# EAGLE design SensoryOverload-v1.0 (EAGLE 6.5.0)
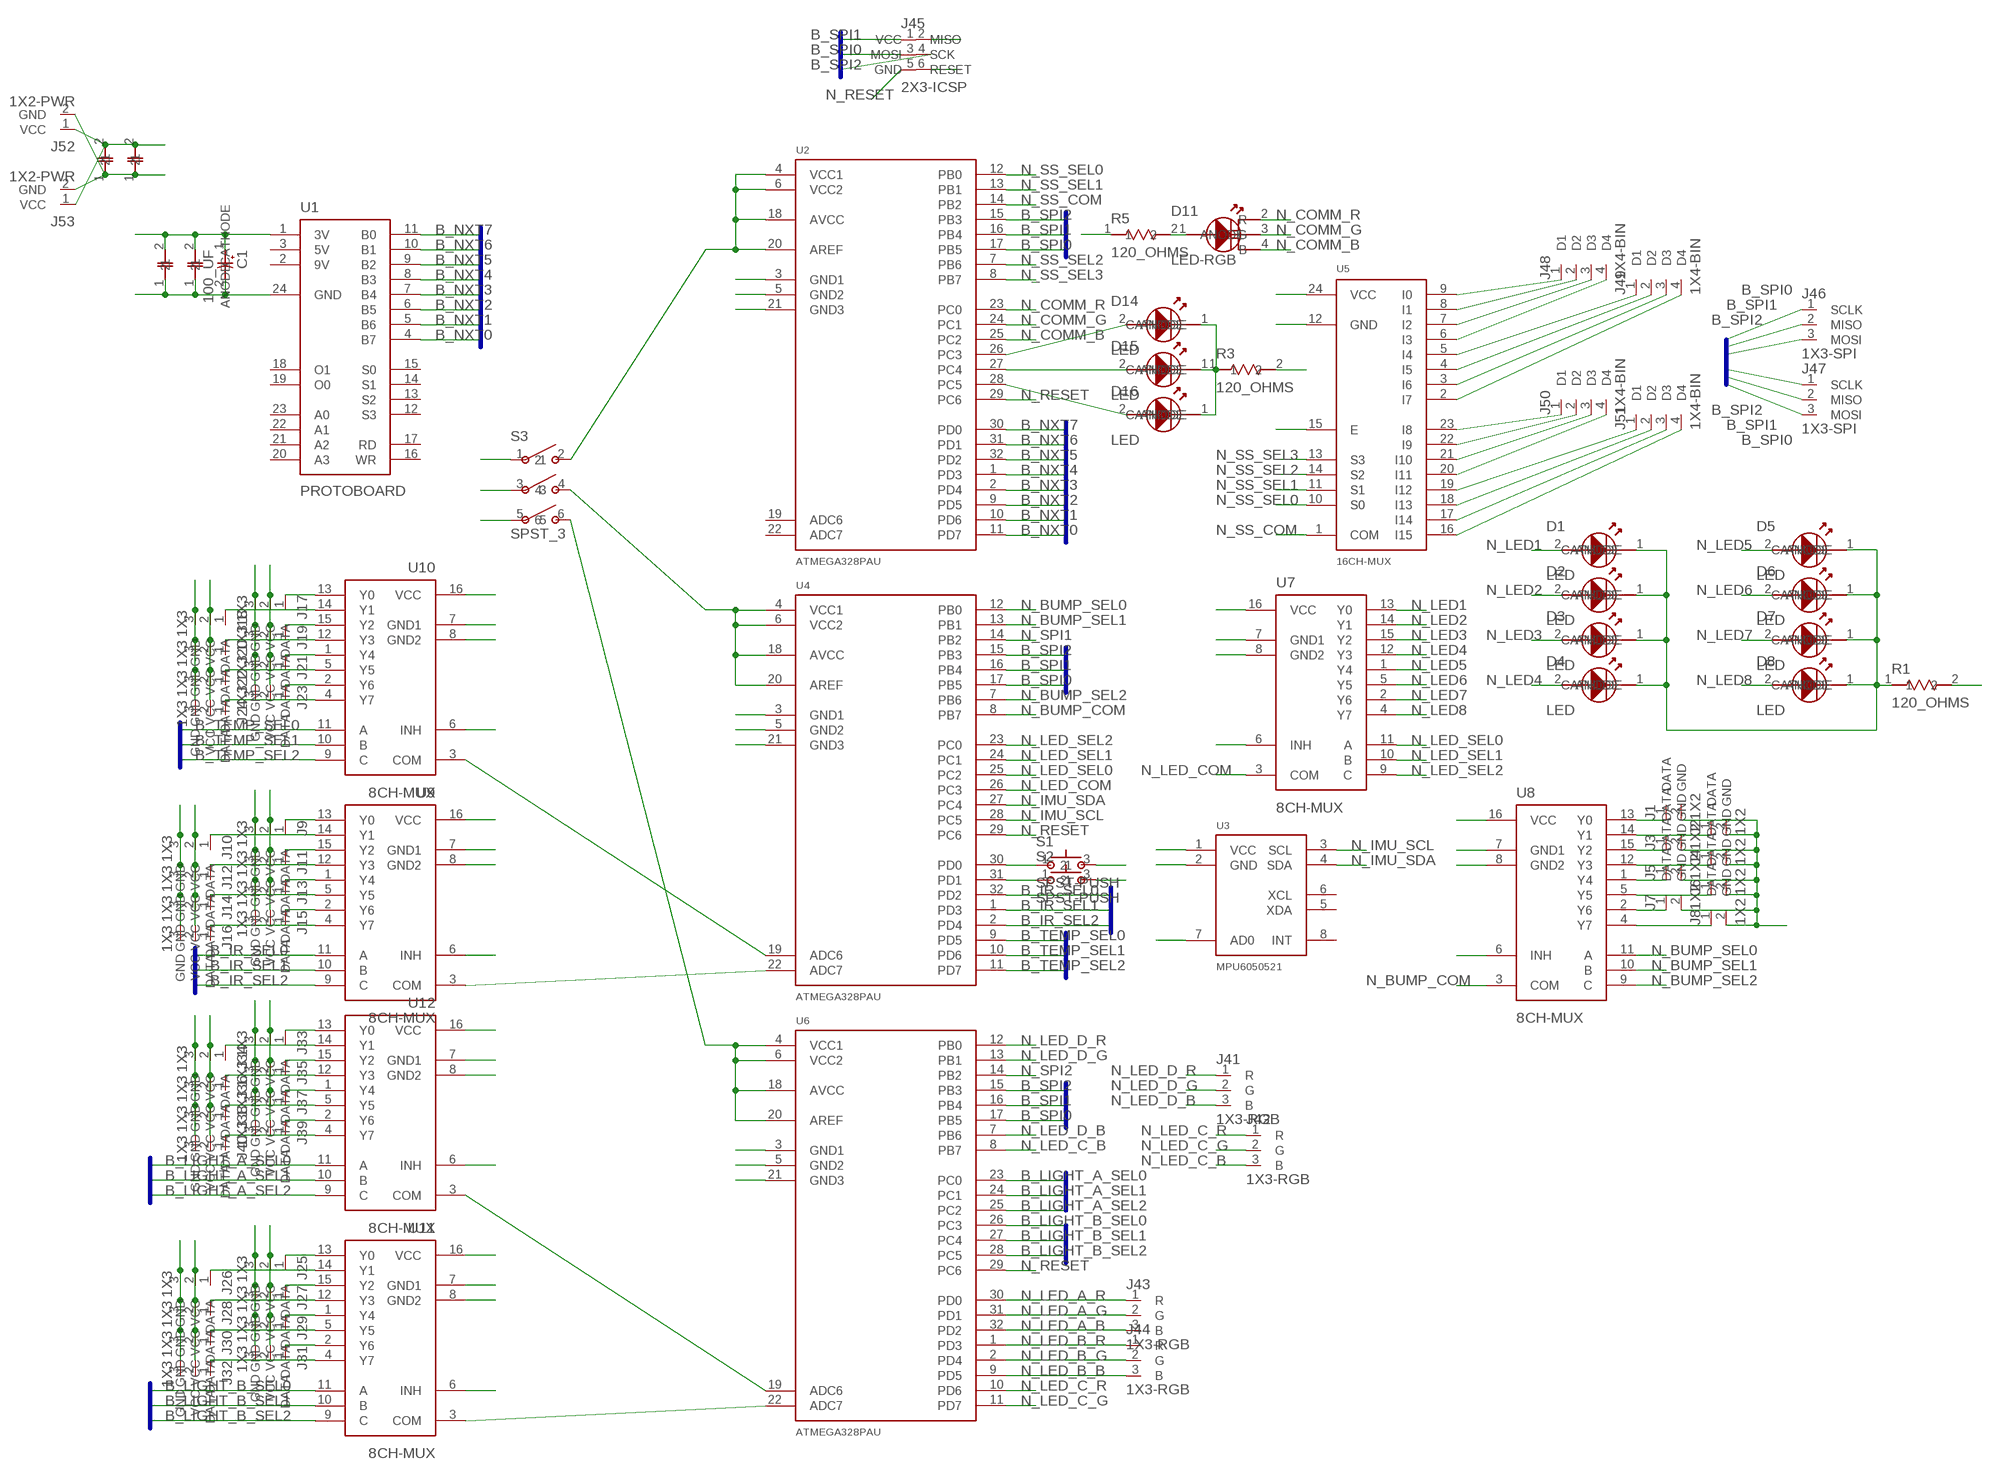
[diagram p0: schematic, sheet 1]

## Parts
C1  100_UF  [AVE-D]
C2  0.1_UF  [0603]
C3  10_PF  [0603]
C4  10_PF  [0603]
C5  0.1_UF  [0603]
D1  LED  [0603]
D2  LED  [0603]
D3  LED  [0603]
D4  LED  [0603]
D5  LED  [0603]
D6  LED  [0603]
D7  LED  [0603]
D8  LED  [0603]
D11  LED-RGB  [PLCC4]
D14  LED  [0603]
D15  LED  [0603]
D16  LED  [0603]
J1  1X2  [1X2]
J2  1X2  [1X2]
J3  1X2  [1X2]
J4  1X2  [1X2]
J5  1X2  [1X2]
J6  1X2  [1X2]
J7  1X2  [1X2]
J8  1X2  [1X2]
J9  1X3  [1X3]
J10  1X3  [1X3]
J11  1X3  [1X3]
J12  1X3  [1X3]
J13  1X3  [1X3]
J14  1X3  [1X3]
J15  1X3  [1X3]
J16  1X3  [1X3]
J17  1X3  [1X3]
J18  1X3  [1X3]
J19  1X3  [1X3]
J20  1X3  [1X3]
J21  1X3  [1X3]
J22  1X3  [1X3]
J23  1X3  [1X3]
J24  1X3  [1X3]
J25  1X3  [1X3]
J26  1X3  [1X3]
J27  1X3  [1X3]
J28  1X3  [1X3]
J29  1X3  [1X3]
J30  1X3  [1X3]
J31  1X3  [1X3]
J32  1X3  [1X3]
J33  1X3  [1X3]
J34  1X3  [1X3]
J35  1X3  [1X3]
J36  1X3  [1X3]
J37  1X3  [1X3]
J38  1X3  [1X3]
J39  1X3  [1X3]
J40  1X3  [1X3]
J41  1X3-RGB  [1X3]
J42  1X3-RGB  [1X3]
J43  1X3-RGB  [1X3]
J44  1X3-RGB  [1X3]
J45  2X3-ICSP  [2X3]
J46  1X3-SPI  [1X3]
J47  1X3-SPI  [1X3]
J48  1X4-BIN  [1X4]
J49  1X4-BIN  [1X4]
J50  1X4-BIN  [1X4]
J51  1X4-BIN  [1X4]
J52  1X2-PWR  [1X2]
J53  1X2-PWR  [1X2]
R1  120_OHMS  [0603]
R3  120_OHMS  [0603]
R5  120_OHMS  [0603]
S1  SPST-PUSH  [SMD]
S2  SPST-PUSH  [SMD]
S3  SPST_3  [DIP_3]
U1  PROTOBOARD  [HEADER]
U2  ATMEGA328PAU  [TQFP32]
U3  MPU6050521  [BREAKOUT]
U4  ATMEGA328PAU  [TQFP32]
U5  16CH-MUX  [SOIC24]
U6  ATMEGA328PAU  [TQFP32]
U7  8CH-MUX  [TSSOP16]
U8  8CH-MUX  [TSSOP16]
U9  8CH-MUX  [TSSOP16]
U10  8CH-MUX  [TSSOP16]
U11  8CH-MUX  [TSSOP16]
U12  8CH-MUX  [TSSOP16]

## Nets
B_IR_SEL0: U4.32(PD2) U9.11(A)
B_IR_SEL1: U4.1(PD3) U9.10(B)
B_IR_SEL2: U4.2(PD4) U9.9(C)
B_LIGHT_A_SEL0: U6.23(PC0) U12.11(A)
B_LIGHT_A_SEL1: U6.24(PC1) U12.10(B)
B_LIGHT_A_SEL2: U6.25(PC2) U12.9(C)
B_LIGHT_B_SEL0: U6.26(PC3) U11.11(A)
B_LIGHT_B_SEL1: U6.27(PC4) U11.10(B)
B_LIGHT_B_SEL2: U6.28(PC5) U11.9(C)
B_NXT0: U1.4(B7) U2.11(PD7)
B_NXT1: U1.5(B6) U2.10(PD6)
B_NXT2: U1.6(B5) U2.9(PD5)
B_NXT3: U1.7(B4) U2.2(PD4)
B_NXT4: U1.8(B3) U2.1(PD3)
B_NXT5: U1.9(B2) U2.32(PD2)
B_NXT6: U1.10(B1) U2.31(PD1)
B_NXT7: U1.11(B0) U2.30(PD0)
B_SPI0: J45.3(SCK) J46.1(SCLK) J47.1(SCLK) U2.17(PB5) U4.17(PB5) U6.17(PB5)
B_SPI1: J45.1(MISO) J46.2(MISO) J47.2(MISO) U2.16(PB4) U4.16(PB4) U6.16(PB4)
B_SPI2: J45.4(MOSI) J46.3(MOSI) J47.3(MOSI) U2.15(PB3) U4.15(PB3) U6.15(PB3)
B_TEMP_SEL0: U4.9(PD5) U10.11(A)
B_TEMP_SEL1: U4.10(PD6) U10.10(B)
B_TEMP_SEL2: U4.11(PD7) U10.9(C)
N_BUMP0: J1.1(DATA) U8.13(Y0)
N_BUMP1: J2.1(DATA) U8.14(Y1)
N_BUMP2: J3.1(DATA) U8.15(Y2)
N_BUMP3: J4.1(DATA) U8.12(Y3)
N_BUMP4: J5.1(DATA) U8.1(Y4)
N_BUMP5: J6.1(DATA) U8.5(Y5)
N_BUMP6: J7.1(DATA) U8.2(Y6)
N_BUMP7: J8.1(DATA) U8.4(Y7)
N_BUMP_COM: U4.8(PB7) U8.3(COM)
N_BUMP_SEL0: U4.12(PB0) U8.11(A)
N_BUMP_SEL1: U4.13(PB1) U8.10(B)
N_BUMP_SEL2: U4.7(PB6) U8.9(C)
N_COMM_B: D11.4(B) U2.25(PC2)
N_COMM_G: D11.3(G) U2.24(PC1)
N_COMM_R: D11.2(R) U2.23(PC0)
N_GND: C1.2(CATHODE) C2.1 C3.1 C4.1 C5.1 J1.2(GND) J2.2(GND) J3.2(GND) J4.2(GND) J5.2(GND) J6.2(GND) J7.2(GND) J8.2(GND) J9.3(GND) J10.3(GND) J11.3(GND) J12.3(GND) J13.3(GND) J14.3(GND) J15.3(GND) J16.3(GND) J17.3(GND) J18.3(GND) J19.3(GND) J20.3(GND) J21.3(GND) J22.3(GND) J23.3(GND) J24.3(GND) J25.3(GND) J26.3(GND) J27.3(GND) J28.3(GND) J29.3(GND) J30.3(GND) J31.3(GND) J32.3(GND) J33.3(GND) J34.3(GND) J35.3(GND) J36.3(GND) J37.3(GND) J38.3(GND) J39.3(GND) J40.3(GND) J45.6(GND) J52.2(GND) J53.2(GND) R1.2 R3.2 S1.3 S2.3 U1.24(GND) U2.3(GND1) U2.5(GND2) U2.21(GND3) U3.2(GND) U3.7(AD0) U5.12(GND) U5.15(E) U7.6(INH) U7.7(GND1) U7.8(GND2) U8.6(INH) U8.7(GND1) U8.8(GND2) U9.6(INH) U9.7(GND1) U9.8(GND2) U10.6(INH) U10.7(GND1) U10.8(GND2) U11.6(INH) U11.7(GND1) U11.8(GND2) U12.6(INH) U12.7(GND1) U12.8(GND2)
N_IMU_SCL: U3.3(SCL) U4.28(PC5)
N_IMU_SDA: U3.4(SDA) U4.27(PC4)
N_IR0: J9.1(DATA) U9.13(Y0)
N_IR1: J10.1(DATA) U9.14(Y1)
N_IR2: J11.1(DATA) U9.15(Y2)
N_IR3: J12.1(DATA) U9.12(Y3)
N_IR4: J13.1(DATA) U9.1(Y4)
N_IR5: J14.1(DATA) U9.5(Y5)
N_IR6: J15.1(DATA) U9.2(Y6)
N_IR7: J16.1(DATA) U9.4(Y7)
N_IR_COM: U4.22(ADC7) U9.3(COM)
N_LED1: D1.2(ANODE) U7.13(Y0)
N_LED2: D2.2(ANODE) U7.14(Y1)
N_LED3: D3.2(ANODE) U7.15(Y2)
N_LED4: D4.2(ANODE) U7.12(Y3)
N_LED5: D5.2(ANODE) U7.1(Y4)
N_LED6: D6.2(ANODE) U7.5(Y5)
N_LED7: D7.2(ANODE) U7.2(Y6)
N_LED8: D8.2(ANODE) U7.4(Y7)
N_LED_A_B: J43.3(B) U6.32(PD2)
N_LED_A_G: J43.2(G) U6.31(PD1)
N_LED_A_R: J43.1(R) U6.30(PD0)
N_LED_B_B: J44.3(B) U6.9(PD5)
N_LED_B_G: J44.2(G) U6.2(PD4)
N_LED_B_R: J44.1(R) U6.1(PD3)
N_LED_C_B: J42.3(B) U6.8(PB7)
N_LED_C_G: J42.2(G) U6.11(PD7)
N_LED_C_R: J42.1(R) U6.10(PD6)
N_LED_COM: U4.26(PC3) U7.3(COM)
N_LED_COMM_A: D14.1(CATHODE) D15.1(CATHODE) D16.1(CATHODE) R3.1
N_LED_COMM_B: D11.1(ANODE) R5.2
N_LED_D_B: J41.3(B) U6.7(PB6)
N_LED_D_G: J41.2(G) U6.13(PB1)
N_LED_D_R: J41.1(R) U6.12(PB0)
N_LED_GND: D1.1(CATHODE) D2.1(CATHODE) D3.1(CATHODE) D4.1(CATHODE) D5.1(CATHODE) D6.1(CATHODE) D7.1(CATHODE) D8.1(CATHODE) R1.1
N_LED_SEL0: U4.25(PC2) U7.11(A)
N_LED_SEL1: U4.24(PC1) U7.10(B)
N_LED_SEL2: U4.23(PC0) U7.9(C)
N_LIGHT_A0: J33.1(DATA) U12.13(Y0)
N_LIGHT_A1: J34.1(DATA) U12.14(Y1)
N_LIGHT_A2: J35.1(DATA) U12.15(Y2)
N_LIGHT_A3: J36.1(DATA) U12.12(Y3)
N_LIGHT_A4: J37.1(DATA) U12.1(Y4)
N_LIGHT_A5: J38.1(DATA) U12.5(Y5)
N_LIGHT_A6: J39.1(DATA) U12.2(Y6)
N_LIGHT_A7: J40.1(DATA) U12.4(Y7)
N_LIGHT_A_COM: U12.3(COM)
N_LIGHT_B0: J25.1(DATA) U11.13(Y0)
N_LIGHT_B1: J26.1(DATA) U11.14(Y1)
N_LIGHT_B2: J27.1(DATA) U11.15(Y2)
N_LIGHT_B3: J28.1(DATA) U11.12(Y3)
N_LIGHT_B4: J29.1(DATA) U11.1(Y4)
N_LIGHT_B5: J30.1(DATA) U11.5(Y5)
N_LIGHT_B6: J31.1(DATA) U11.2(Y6)
N_LIGHT_B7: J32.1(DATA) U11.4(Y7)
N_LIGHT_B_COM: U11.3(COM)
N_PUSH0: S1.1 U4.30(PD0)
N_PUSH1: S2.1 U4.31(PD1)
N_RESET: J45.5(RESET) U2.29(PC6) U4.29(PC6) U6.29(PC6)
N_SPI1: J48.1(D1) U4.14(PB2) U5.9(I0)
N_SPI2: J48.2(D2) U5.8(I1) U6.14(PB2)
N_SPI3: J48.3(D3) U5.7(I2)
N_SPI4: J48.4(D4) U5.6(I3)
N_SPI5: J49.1(D1) U5.5(I4)
N_SPI6: J49.2(D2) U5.4(I5)
N_SPI7: J49.3(D3) U5.3(I6)
N_SPI8: J49.4(D4) U5.2(I7)
N_SPI9: J50.1(D1) U5.23(I8)
N_SPI10: J50.2(D2) U5.22(I9)
N_SPI11: J50.3(D3) U5.21(I10)
N_SPI12: J50.4(D4) U5.20(I11)
N_SPI13: J51.1(D1) U5.19(I12)
N_SPI14: J51.2(D2) U5.18(I13)
N_SPI15: J51.3(D3) U5.17(I14)
N_SPI16: J51.4(D4) U5.16(I15)
N_SS_COM: U2.14(PB2) U5.1(COM)
N_SS_SEL0: U2.12(PB0) U5.10(S0)
N_SS_SEL1: U2.13(PB1) U5.11(S1)
N_SS_SEL2: U2.7(PB6) U5.14(S2)
N_SS_SEL3: U2.8(PB7) U5.13(S3)
N_STATUS_LED0: D14.2(ANODE) U2.26(PC3)
N_STATUS_LED1: D15.2(ANODE) U2.27(PC4)
N_STATUS_LED2: D16.2(ANODE) U2.28(PC5)
N_TEMP0: J17.1(DATA) U10.13(Y0)
N_TEMP1: J18.1(DATA) U10.14(Y1)
N_TEMP2: J19.1(DATA) U10.15(Y2)
N_TEMP3: J20.1(DATA) U10.12(Y3)
N_TEMP4: J21.1(DATA) U10.1(Y4)
N_TEMP5: J22.1(DATA) U10.5(Y5)
N_TEMP6: J23.1(DATA) U10.2(Y6)
N_TEMP7: J24.1(DATA) U10.4(Y7)
N_TEMP_COM: U4.19(ADC6) U10.3(COM)
N_VCC: C1.1(ANODE) C2.2 C3.2 C4.2 C5.2 J9.2(VCC) J10.2(VCC) J11.2(VCC) J12.2(VCC) J13.2(VCC) J14.2(VCC) J15.2(VCC) J16.2(VCC) J17.2(VCC) J18.2(VCC) J19.2(VCC) J20.2(VCC) J21.2(VCC) J22.2(VCC) J23.2(VCC) J24.2(VCC) J25.2(VCC) J26.2(VCC) J27.2(VCC) J28.2(VCC) J29.2(VCC) J30.2(VCC) J31.2(VCC) J32.2(VCC) J33.2(VCC) J34.2(VCC) J35.2(VCC) J36.2(VCC) J37.2(VCC) J38.2(VCC) J39.2(VCC) J40.2(VCC) J45.2(VCC) J52.1(VCC) J53.1(VCC) R5.1 S3.1 S3.3 S3.5 U1.1(3V) U3.1(VCC) U5.24(VCC) U7.16(VCC) U8.16(VCC) U9.16(VCC) U10.16(VCC) U11.16(VCC) U12.16(VCC)
N_VCC_MCU0: S3.2 U2.4(VCC1) U2.6(VCC2) U2.18(AVCC) U2.20(AREF)
N_VCC_MCU1: S3.4 U4.4(VCC1) U4.6(VCC2) U4.18(AVCC) U4.20(AREF)
N_VCC_MCU2: S3.6 U6.4(VCC1) U6.6(VCC2) U6.18(AVCC) U6.20(AREF)
Unconnected: U1.2(9V) U1.3(5V) U1.12(S3) U1.13(S2) U1.14(S1) U1.15(S0) U1.16(WR) U1.17(RD) U1.18(O1) U1.19(O0) U1.20(A3) U1.21(A2) U1.22(A1) U1.23(A0) U2.19(ADC6) U2.22(ADC7) U3.5(XDA) U3.6(XCL) U3.8(INT) U6.19(ADC6) U6.22(ADC7)

## Buses
B_NXT[0..7]
B_SPI[0..2]
B_IR_SEL[0..2]
B_TEMP_SEL[0..2]
B_LIGHT_A_SEL[0..2]
B_LIGHT_B_SEL[0..2]

## Power pins joined to a net without a drawn wire
GND1: U4.3(GND1) U6.3(GND1)
GND2: U4.5(GND2) U6.5(GND2)
GND3: U4.21(GND3) U6.21(GND3)

## Library data of the parts
C1 = Capacitors:100_UF
C2 C5 = Capacitors:0.1_UF
C3 C4 = Capacitors:10_PF
D1-D8 D14-D16 = LEDs:LED
D11 = LEDs:LED-RGB
J1-J8 = Headers:1X2
J9-J40 = Headers:1X3
J41-J44 = Headers:1X3-RGB
J45 = Headers:2X3-ICSP
J46 J47 = Headers:1X3-SPI
J48-J51 = Headers:1X4-BIN
J52 J53 = Headers:1X2-PWR
R1 R3 R5 = Resistors:120_OHMS
S1 S2 = Switches:SPST-PUSH
S3 = Switches:SPST_3
U1 = HiTechnic:PROTOBOARD
U2 U4 U6 = ATmega328p:ATMEGA328P
U3 = MPU6050:MPU6050
U5 = TI:16CH-MUX
U7-U12 = TI:8CH-MUX

## Board
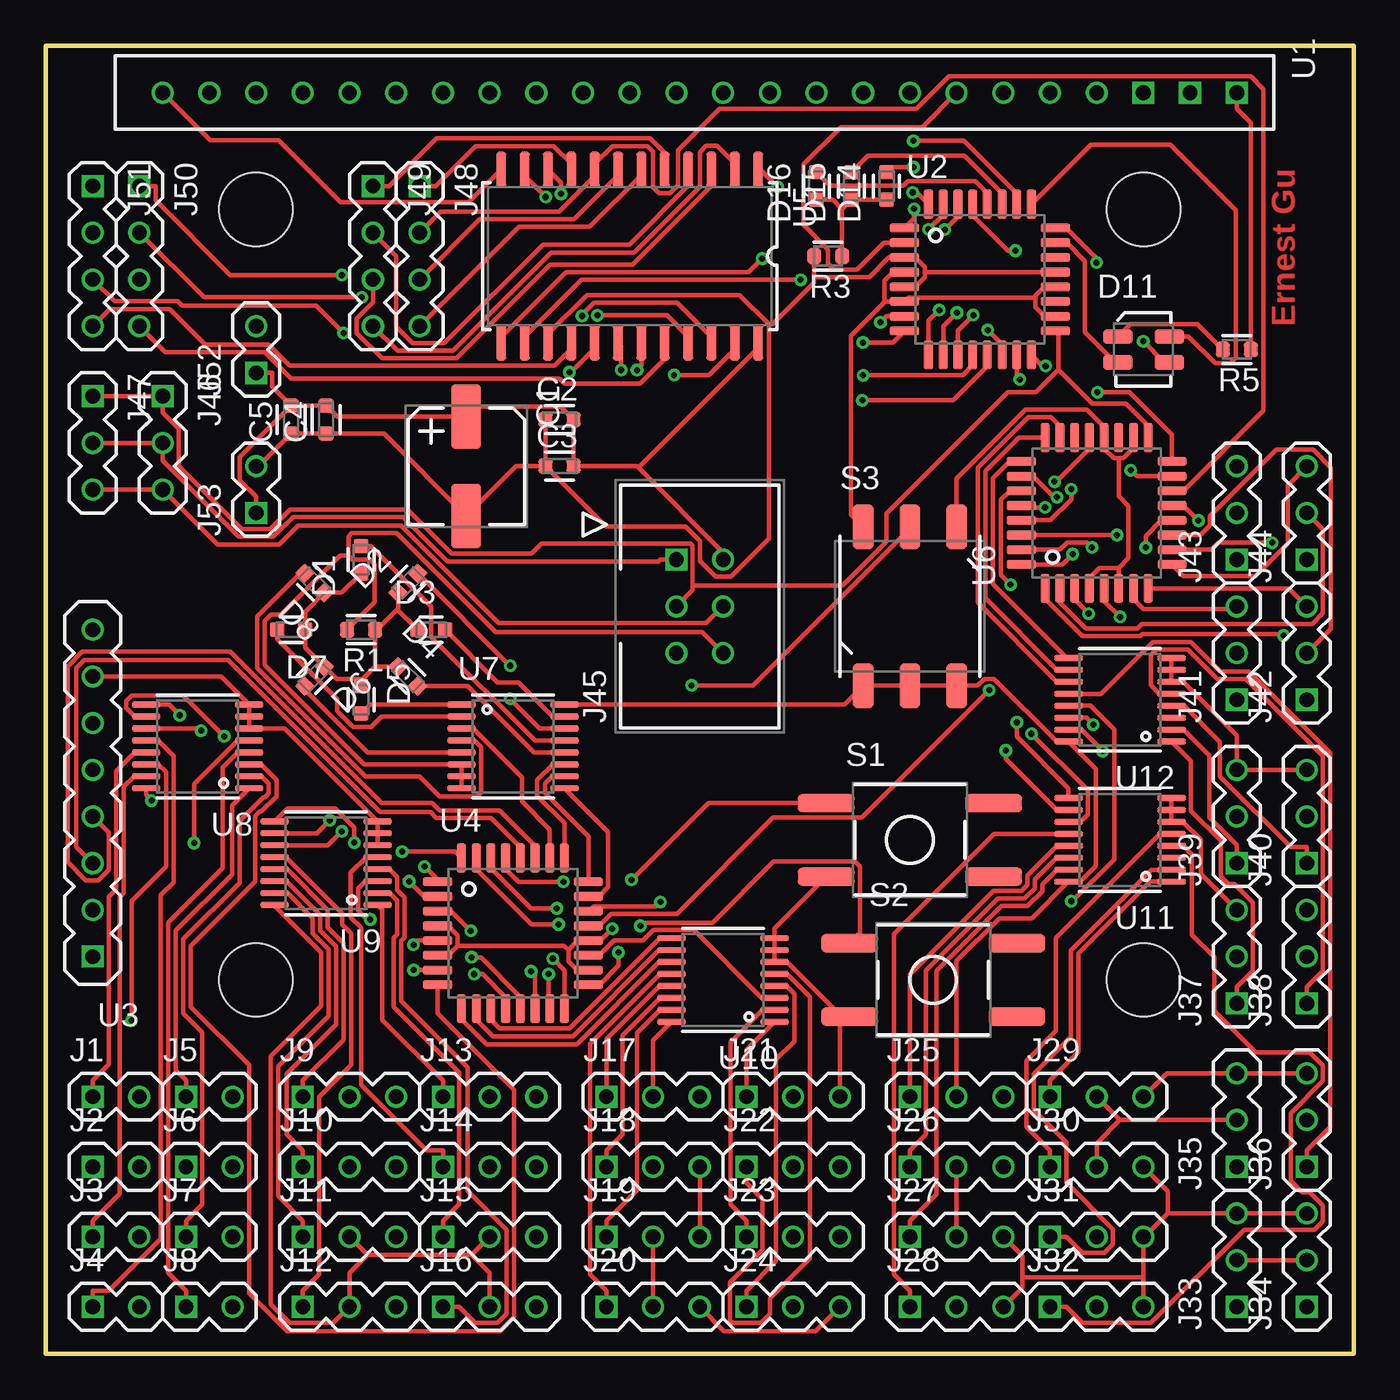
[diagram p1: board, top side]
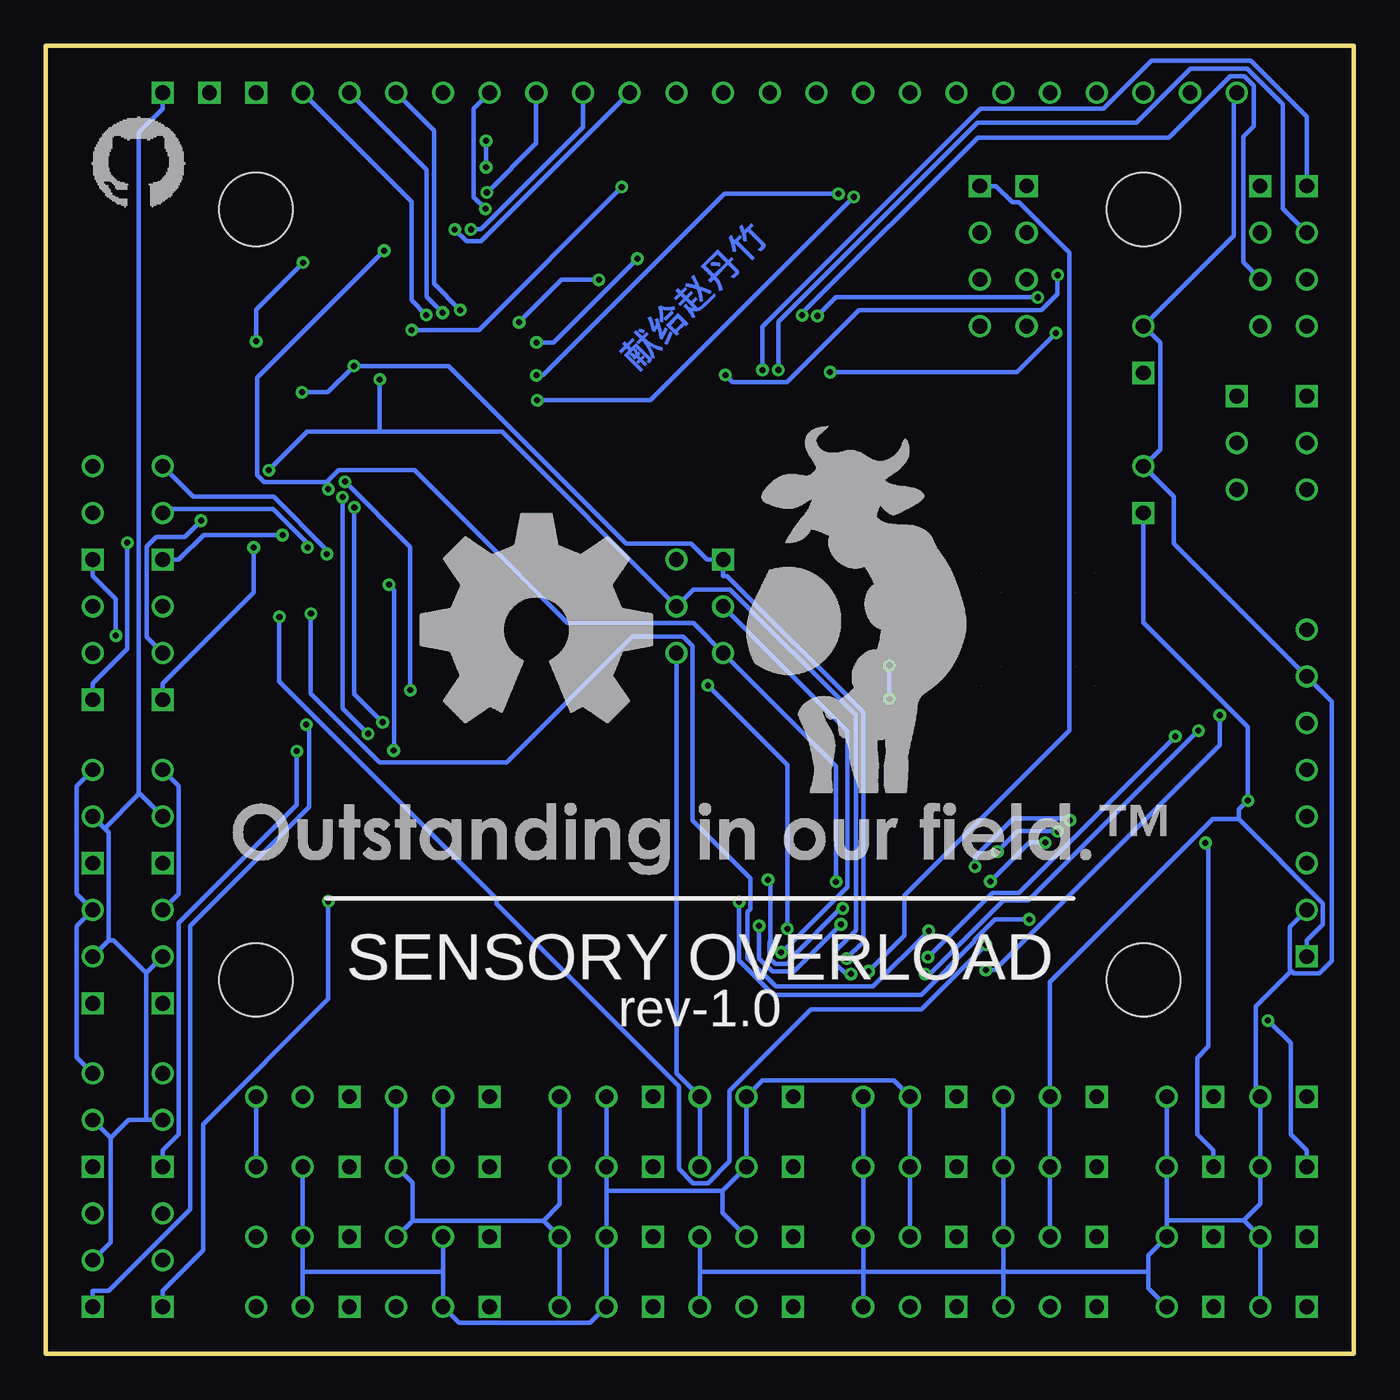
[diagram p2: board, bottom side, seen from below]

Size 71.12 x 71.12 mm. Coordinates in mm from the lower left corner, seen from the top.
Outline: 0,0 71.12,0 71.12,71.12 0,71.12 0,0
Copper layers (1*16): Top 0.0356mm / dielectric 1.5011mm / Bottom 0.0356mm
Design rules "OSHpark-tented": minimum track width 10mil, minimum drill 13mil, track to track 6mil, track to pad 6mil, pad to pad 6mil, via to via 6mil, smd to smd 6mil, copper to edge 15mil, drill to drill 6mil, minimum pad ring 7mil, minimum via ring 7mil, stop-mask expansion 3mil, vias tented up to drill 25mil, thermal gap 10mil
tRestrict: area 66.5,55.6 to 68.1,65.8

### Footprints (pad centres in the part's own frame; a part is rotated, then mirrored left to right if it is on the bottom)
AVE-D = smd 3.5 x 1.6: 1 -2.7,0; 2 2.7,0
0603 = smd 0.787 x 0.864: 1 -0.762,0; 2 0.762,0
0603' = smd 0.8 x 0.8: 1 0,-0.75; 2 0,0.75
PLCC4 = smd 1.6 x 0.8: 1 -1.4,0.7; 2 -1.4,-0.7; 3 1.4,-0.7; 4 1.4,0.7
1X2 = drill 0.8 square: 1 -1.27,0 | drill 0.8: 2 1.27,0
1X3 = drill 0.8 square: 1 -2.54,0 | drill 0.8: 2 0,0; 3 2.54,0
2X3 = drill 0.8 square: 1 -1.27,2.54 | drill 0.8: 2 1.27,2.54; 3 -1.27,0; 4 1.27,0; 5 -1.27,-2.54; 6 1.27,-2.54
1X4 = drill 0.8 square: 1 -3.81,0 | drill 0.8: 2 -1.27,0; 3 1.27,0; 4 3.81,0
SMD = smd 3.1 x 1: 1 -4.55,2; 2 4.55,2; 3 -4.55,-2; 4 4.55,-2
DIP_3 = smd 1.118 x 2.438: 1 -2.54,-4.318; 2 -2.54,4.318; 3 0,-4.318; 4 0,4.318; 5 2.54,-4.318; 6 2.54,4.318
HEADER = drill 0.8 square: 1 0,0; 2 0,-2.54; 3 0,-5.08 | drill 0.8: 4 0,-7.62; 5 0,-10.16; 6 0,-12.7; 7 0,-15.24; 8 0,-17.78; 9 0,-20.32; 10 0,-22.86; 11 0,-25.4; 12 0,-27.94; 13 0,-30.48; 14 0,-33.02; 15 0,-35.56; 16 0,-38.1; 17 0,-40.64; 18 0,-43.18; 19 0,-45.72; 20 0,-48.26; 21 0,-50.8; 22 0,-53.34; 23 0,-55.88; 24 0,-58.42
TQFP32 = smd 1.6 x 0.5: 1 -4.1,2.8; 2 -4.1,2; 3 -4.1,1.2; 4 -4.1,0.4; 5 -4.1,-0.4; 6 -4.1,-1.2; 7 -4.1,-2; 8 -4.1,-2.8; 17 4.1,-2.8; 18 4.1,-2; 19 4.1,-1.2; 20 4.1,-0.4; 21 4.1,0.4; 22 4.1,1.2; 23 4.1,2; 24 4.1,2.8 | smd 0.5 x 1.6: 9 -2.8,-4.1; 10 -2,-4.1; 11 -1.2,-4.1; 12 -0.4,-4.1; 13 0.4,-4.1; 14 1.2,-4.1; 15 2,-4.1; 16 2.8,-4.1; 25 2.8,4.1; 26 2,4.1; 27 1.2,4.1; 28 0.4,4.1; 29 -0.4,4.1; 30 -1.2,4.1; 31 -2,4.1; 32 -2.8,4.1
BREAKOUT = drill 0.8 square: 1 0,8.89 | drill 0.8: 2 0,6.35; 3 0,3.81; 4 0,1.27; 5 0,-1.27; 6 0,-3.81; 7 0,-6.35; 8 0,-8.89
SOIC24 = smd 1.95 x 0.55: 1 -4.7,6.985; 2 -4.7,5.715; 3 -4.7,4.445; 4 -4.7,3.175; 5 -4.7,1.905; 6 -4.7,0.635; 7 -4.7,-0.635; 8 -4.7,-1.905; 9 -4.7,-3.175; 10 -4.7,-4.445; 11 -4.7,-5.715; 12 -4.7,-6.985; 13 4.7,-6.985; 14 4.7,-5.715; 15 4.7,-4.445; 16 4.7,-3.175; 17 4.7,-1.905; 18 4.7,-0.635; 19 4.7,0.635; 20 4.7,1.905; 21 4.7,3.175; 22 4.7,4.445; 23 4.7,5.715; 24 4.7,6.985
TSSOP16 = smd 1.55 x 0.3: 1 -2.8,2.275; 2 -2.8,1.625; 3 -2.8,0.975; 4 -2.8,0.325; 5 -2.8,-0.325; 6 -2.8,-0.975; 7 -2.8,-1.625; 8 -2.8,-2.275; 9 2.8,-2.275; 10 2.8,-1.625; 11 2.8,-0.975; 12 2.8,-0.325; 13 2.8,0.325; 14 2.8,0.975; 15 2.8,1.625; 16 2.8,2.275
STANDOFF = hole 4: 0,0

### Placement (x,y rotation side)
C1  22.86,48.26 270 top
C2  27.94,50.8 0 top
C3  27.94,48.26 0 top
C4  15.24,50.8 90 top
C5  13.34,50.8 90 top
D1  LED  [0603']  17.14,43.18 0 top
D2  LED  [0603']  19.68,41.91 315 top
D3  LED  [0603']  20.95,39.37 270 top
D4  LED  [0603']  19.68,36.83 225 top
D5  LED  [0603']  17.14,35.56 180 top
D6  LED  [0603']  14.61,36.83 135 top
D7  LED  [0603']  13.34,39.37 90 top
D8  LED  [0603']  14.61,41.91 45 top
D11  59.69,54.61 0 top
D14  LED  [0603']  45.72,63.5 0 top
D15  LED  [0603']  43.81,63.5 0 top
D16  LED  [0603']  41.91,63.5 0 top
J1  3.81,13.97 0 top
J2  3.81,10.16 0 top
J3  3.81,6.35 0 top
J4  3.81,2.54 0 top
J5  8.89,13.97 0 top
J6  8.89,10.16 0 top
J7  8.89,6.35 0 top
J8  8.89,2.54 0 top
J9  16.51,13.97 0 top
J10  16.51,10.16 0 top
J11  16.51,6.35 0 top
J12  16.51,2.54 0 top
J13  24.13,13.97 0 top
J14  24.13,10.16 0 top
J15  24.13,6.35 0 top
J16  24.13,2.54 0 top
J17  33.02,13.97 0 top
J18  33.02,10.16 0 top
J19  33.02,6.35 0 top
J20  33.02,2.54 0 top
J21  40.64,13.97 0 top
J22  40.64,10.16 0 top
J23  40.64,6.35 0 top
J24  40.64,2.54 0 top
J25  49.53,13.97 0 top
J26  49.53,10.16 0 top
J27  49.53,6.35 0 top
J28  49.53,2.54 0 top
J29  57.15,13.97 0 top
J30  57.15,10.16 0 top
J31  57.15,6.35 0 top
J32  57.15,2.54 0 top
J33  64.77,5.08 90 top
J34  68.58,5.08 90 top
J35  64.77,12.7 90 top
J36  68.58,12.7 90 top
J37  64.77,21.59 90 top
J38  68.58,21.59 90 top
J39  64.77,29.21 90 top
J40  68.58,29.21 90 top
J41  64.77,38.1 90 top
J42  68.58,38.1 90 top
J43  64.77,45.72 90 top
J44  68.58,45.72 90 top
J45  35.56,40.64 0 top
J46  6.35,49.53 270 top
J47  2.54,49.53 270 top
J48  20.32,59.69 270 top
J49  17.78,59.69 270 top
J50  5.08,59.69 270 top
J51  2.54,59.69 270 top
J52  11.43,54.61 90 top
J53  11.43,46.99 90 top
R1  17.14,39.37 180 top
R3  42.55,59.69 180 top
R5  64.77,54.61 180 top
S1  46.99,27.94 0 top
S2  48.26,20.32 0 top
S3  46.99,40.64 0 top
U1  64.77,68.58 270 top
U2  50.8,58.42 0 top
U3  2.54,30.48 180 top
U4  25.4,22.86 0 top
U5  31.75,59.69 270 top
U6  57.15,45.72 90 top
U7  25.4,33.02 0 top
U8  8.26,33.02 180 top
U9  15.24,26.67 180 top
U10  36.83,20.32 180 top
U11  58.42,27.94 180 top
U12  58.42,35.56 180 top
U$1  [STANDOFF]  11.43,20.32 0 top
U$2  [STANDOFF]  59.69,20.32 0 top
U$3  [STANDOFF]  59.69,62.23 0 top
U$4  [STANDOFF]  11.43,62.23 0 top
U$5  [DEDICATION]  35.05,56.77 315 top
U$6  [LOGO-OLYCOW]  27.94,30.48 0 top
U$7  [SLOGAN-OLYCOW]  35.56,26.04 0 top
U$8  [LOGO-OSHW]  44.45,34.29 0 top
U$9  [LOGO-GITHUB]  66.04,64.77 0 top

### Tracks (layer width: path | path; a pad name or v marks a point on that pad's centre or on a via)
B_IR_SEL0  (via drill 0.33 pad 0.69)
  Top 0.254: U9.11 15.32,27.64 v16.09,28.41 | U4.32 22.26,27.3 v19.37,27.3
  Bottom 0.254: v19.37,27.3 18.26,28.42 16.09,28.42 v16.09,28.41
B_IR_SEL1  (via drill 0.33 pad 0.69)
  Top 0.254: U9.10 14.73,28.3 v15.43,29 | v20.59,26.49 21.3,25.77 U4.1
  Bottom 0.254: v20.59,26.49 20.59,27.02 18.51,29.09 15.53,29.09 v15.43,29
B_IR_SEL2  (via drill 0.33 pad 0.69)
  Top 0.254: U4.2 20.57,24.86 v19.75,25.68 | v16.77,27.8 16.77,28.61 15.74,29.64 13.13,29.64 U9.9
  Bottom 0.254: v16.77,27.8 17.63,27.8 v19.75,25.68
B_LIGHT_A_SEL0
  Top 0.254: U12.11 54.99,36.53 50.69,40.84 50.69,48.18 53.44,50.93 54.67,50.93 55.15,50.45 U6.23
B_LIGHT_A_SEL1
  Top 0.254: U12.10 54.99,37.19 51.09,41.09 51.09,48.01 52.91,49.82 U6.24
B_LIGHT_A_SEL2
  Top 0.254: U12.9 55.53,37.84 51.5,41.87 51.5,47.62 52.4,48.52 U6.25
B_LIGHT_B_SEL0  (via drill 0.33 pad 0.69)
  Top 0.254: U6.26 53.67,47.72 54.81,46.58 v54.99,46.58 | U11.11 56.26,28.91 56.68,29.33 56.68,30.64 v53.61,33.71
  Bottom 0.254: v53.61,33.71 54.99,35.09 v54.99,46.58
B_LIGHT_B_SEL1  (via drill 0.33 pad 0.69)
  Top 0.254: U11.10 54.98,29.57 52.21,32.34 v52.21,32.8 | v52.47,41.82 51.94,42.34 51.94,46.44 52.42,46.92 U6.27
  Bottom 0.254: v52.47,41.82 52.19,41.54 52.19,32.82 v52.21,32.8
B_LIGHT_B_SEL2  (via drill 0.33 pad 0.69)
  Top 0.254: U11.9 55.62,30.74 52.81,33.55 v52.81,34.34 | v54.35,46.02 53.15,46.02 U6.28
  Bottom 0.254: v54.35,46.02 54.35,35.87 v52.81,34.34
B_NXT0  (via drill 0.33 pad 0.69)
  Top 0.254: U2.11 49.6,55.65 v50.44,56.49
  Bottom 0.254: v50.44,56.49 51.23,57.28 51.23,62.66 U1.4
B_NXT1  (via drill 0.33 pad 0.69)
  Top 0.254: U2.10 48.8,55.87 v49.54,56.62
  Bottom 0.254: U1.5 50.42,64.39 50.42,57.49 v49.54,56.62
B_NXT2  (via drill 0.33 pad 0.69)
  Top 0.254: U2.9 48,56.18 v48.58,56.76
  Bottom 0.254: U1.6 50.01,66.52 50.01,58.19 v48.58,56.76
B_NXT3
  Top 0.254: U2.2 45.58,60.42 44.12,58.96 42.86,58.96 42.55,59.28 42.55,60.05 41.21,61.39 41.21,64.69 43.23,66.71 47.66,66.71 U1.7
B_NXT4  (via drill 0.33 pad 0.69)
  Top 0.254: U2.1 47.22,61.73 v47.22,62.27
  Bottom 0.254: v47.22,62.27 47.85,62.9 47.85,67.72 U1.8
B_NXT5  (via drill 0.33 pad 0.69)
  Top 0.254: U2.32 47.37,63.15 v47.14,63.15
  Bottom 0.254: v47.14,63.15 44.45,65.84 U1.9
B_NXT6  (via drill 0.33 pad 0.69)
  Top 0.254: U2.31 48.8,61.94 v48.01,61.14
  Bottom 0.254: U1.10 41.91,66.69 47.46,61.14 v48.01,61.14
B_NXT7  (via drill 0.33 pad 0.69)
  Top 0.254: U2.30 49.6,61.85 v48.89,61.13
  Bottom 0.254: U1.11 47.45,60.5 48.25,60.5 v48.89,61.13
B_SPI0  (via drill 0.33 pad 0.69)
  Top 0.254: 55.06,53.51 56.91,51.67 58.73,51.67 59.95,50.44 U6.17 | 55.06,53.51 55.06,55.46 U2.17 | 35.17,41.78 43.33,41.78 45.72,44.17 45.72,45.69 52.32,52.29 53.84,52.29 55.06,53.51 | 35.17,41.78 35.17,41.52 J45.3 | 35.17,41.78 35.17,43.95 35.05,44.06 26.95,44.06 26.4,43.51 22.07,43.51 19.67,45.91 13.28,45.91 12.19,44.83 10.66,44.83 7.23,48.26 7.23,50.31 6.35,51.19 J46.1 3.42,52.07 J47.1 | v31.14,21.82 31.14,21.1 30.1,20.06 U4.17
  Bottom 0.254: J45.3 27.51,33.86 27.51,25.39 31.09,21.82 v31.14,21.82
B_SPI1  (via drill 0.33 pad 0.69)
  Top 0.254: U6.16 61.25,49.97 58.93,52.29 v57.2,52.29 | v54.37,53.72 54.2,53.72 U2.16 | J45.1 33.41,43.18 33.31,43.08 21.85,43.08 19.42,45.51 13.44,45.51 12.36,44.42 10.49,44.42 6.35,48.56 J46.2 J47.2 | U4.16 28.2,20.84 v27.57,21.48
  Bottom 0.254: v57.2,52.29 55.8,52.29 v54.37,53.72 49.22,53.72 39.56,44.06 36.05,44.06 35.17,43.18 J45.1 34.29,42.3 34.07,42.3 26.66,34.89 26.66,22.38 v27.57,21.48
B_SPI2  (via drill 0.33 pad 0.69)
  Top 0.254: J45.4 35.91,39.72 24.63,39.72 19.3,45.05 13.7,45.05 12.67,44.01 9.33,44.01 J46.3 J47.3 | U6.15 59.33,47.72 v59,48.05 | U2.15 52.8,53.15 v52.96,52.98 | U4.15 27.34,18.82 v27.34,20.64
  Bottom 0.254: 52.96,50.13 v52.96,52.98 | 52.96,50.13 46.33,50.13 J45.4 35.91,41.56 33.91,41.56 27.07,34.72 27.07,23 28.2,21.87 28.2,21.23 27.61,20.64 v27.34,20.64 | v59,48.05 56.91,50.13 52.96,50.13 | v27.34,20.64
B_TEMP_SEL0
  Top 0.254: U4.9 22.6,18.18 23.96,16.83 28.88,16.83 33.35,21.3 U10.11
B_TEMP_SEL1
  Top 0.254: U4.10 23.4,18.18 24.33,17.26 28.66,17.26 33.34,21.95 U10.10
B_TEMP_SEL2
  Top 0.254: U10.9 33.41,22.59 28.49,17.68 24.68,17.68 24.2,18.16 U4.11
GND1  (via drill 0.33 pad 0.69)
  Top 0.254: v23.1,23 22.04,24.06 U4.3 | U6.3 55.95,41.01 v56.71,40.24
  Bottom 0.254: v56.71,40.24 56.71,35.9 52.97,32.16 46.07,32.16 39.25,38.99 36.46,38.99 35.95,38.47 35.95,28.98 32.79,25.83 32.79,24.19 32.96,24.03 32.96,21.5 31.42,19.96 26.14,19.96 v23.1,23
GND2  (via drill 0.33 pad 0.69)
  Top 0.254: U4.5 20.22,22.46 v19.99,22.23 | U6.5 57.55,40.94 v58.42,40.06
  Bottom 0.254: v58.42,40.06 58.42,36.55 46.61,24.74 46.61,24.45 36.7,14.54 36.7,10.04 35.94,9.27 35.12,9.27 33.94,10.45 33.94,14.29 29.51,18.73 23.5,18.73 v19.99,22.23
GND3  (via drill 0.33 pad 0.69)
  Top 0.254: U6.21 56.75,49.22 54.95,47.42 v54.86,47.42 | v51.31,36.08 44.39,29.16 39.55,29.16 34.32,23.92 30.74,23.92 30.07,23.26 U4.21
  Bottom 0.254: v51.31,36.08 51.31,43.87 v54.86,47.42
N_BUMP0
  Top 0.254: J1.1 2.54,14.85 3.42,15.73 3.42,24.82 3.83,25.23 3.83,31.69 4.83,32.7 U8.13
N_BUMP1  (via drill 0.33 pad 0.69)
  Top 0.254: U8.14 6.11,32.05 6.53,31.63 6.53,26.49 4.65,24.61 v4.65,18.12
  Bottom 0.254: J2.1 2.54,11.04 3.42,11.92 3.42,16.88 v4.65,18.12
N_BUMP2
  Top 0.254: J3.1 2.54,7.23 4,8.69 4,24.83 4.23,25.06 4.23,30.84 4.79,31.39 U8.15
N_BUMP3
  Top 0.254: U8.12 6.11,33.34 6.95,32.51 6.95,25.63 6.25,24.93 6.25,6.25 3.42,3.42 2.54,3.42 J4.1
N_BUMP4
  Top 0.254: J5.1 7.62,14.85 7.06,15.41 7.06,23 10.13,26.07 10.13,29.82 U8.1
N_BUMP5  (via drill 0.33 pad 0.69)
  Top 0.254: U8.5 10.43,33.34 8.05,30.97 v8.05,27.77
  Bottom 0.254: J6.1 7.62,11.04 8.5,11.92 8.5,16.09 7.89,16.71 7.89,27.6 v8.05,27.77
N_BUMP6
  Top 0.254: J7.1 7.62,7.23 8.5,8.11 8.5,17.46 7.47,18.49 7.47,22.55 10.53,25.61 10.53,28.96 11.81,30.24 11.89,30.24 12.12,30.48 12.12,31.01 11.74,31.39 U8.2
N_BUMP7
  Top 0.254: J8.1 7.62,3.42 6.66,4.38 6.66,23.46 9.61,26.41 9.61,31.89 10.42,32.7 U8.4
N_BUMP_COM
  Top 0.254: U8.3 11.7,32.05 12.54,31.2 12.54,30.31 11.71,29.48 11.63,29.48 11.38,29.24 11.38,25.68 7.88,22.18 7.88,18.87 11.04,15.7 11.04,3.28 13.11,1.21 24.69,1.21 25.47,1.99 25.47,14.34 21.3,18.51 U4.8
N_BUMP_SEL0  (via drill 0.33 pad 0.69)
  Top 0.254: v23.3,20.64 23.73,20.64 25,19.37 U4.12 | U8.11 8.33,33.99 v8.44,33.88
  Bottom 0.254: v23.3,20.64 23.05,20.64 19.04,24.65 17.67,24.65 v8.44,33.88
N_BUMP_SEL1  (via drill 0.33 pad 0.69)
  Top 0.254: U4.13 25.8,19.41 23.66,21.55 v23.15,21.55 | U8.10 4.82,34.65 4.37,35.1 4.37,35.49 4.66,35.78 7.48,35.78 v9.69,33.56
  Bottom 0.254: v23.15,21.55 19.64,25.05 18.2,25.05 v9.69,33.56
N_BUMP_SEL2  (via drill 0.33 pad 0.69)
  Top 0.254: U4.7 v19.99,20.86 | U8.9 6.7,35.3 v7.27,34.72
  Bottom 0.254: v7.27,34.72 7.27,33.09 19.51,20.86 v19.99,20.86
N_COMM_B
  Top 0.254: U2.25 56.83,65.75 61.16,65.75 64.72,62.19 64.72,54.17 64.41,53.86 63.6,53.86 62.15,55.31 D11.4
N_COMM_G  (via drill 0.33 pad 0.69)
  Top 0.254: U2.24 55.49,61.22 57.14,59.57 v57.14,59.34 | v59.69,55.06 60.84,53.91 D11.3
  Bottom 0.254: v57.14,59.34 59.69,56.79 v59.69,55.06
N_COMM_R
  Top 0.254: U2.23 55.53,60.42 56.52,59.43 56.52,55.55 58.16,53.91 D11.2
N_GND
  Top 0.254: 16.45,43.39 16.45,44.45 16.63,44.62 19.08,44.62 24.45,39.25 35.68,39.25 J45.6 | C3.1 25.56,48.26 C1.2 18.38,50.04 C4.1 C5.1 11.56,48.26 J53.2 | 39.31,55.98 37.71,57.58 29.42,57.58 27.3,55.47 U5.15 | 43.18,18.32 43.18,18.43 40.31,21.3 U10.6 U10.7 U10.8 39.63,23.13 S1.3 | U3.7 9.52,36.83 U8.8 U8.7 U8.6 12.99,33.99 U9.8 U9.7 U9.6 | R1.2 17.88,40.87 17.88,42.93 17.63,43.18 16.66,43.18 16.45,43.39 | U1.24 8.94,65.99 12.65,65.99 16.02,62.62 23,62.62 U5.12 | C3.1 30.46,44.98 34.78,44.98 35.58,44.19 35.58,43.1 36.43,42.25 37.25,42.25 39.31,44.32 39.31,55.98 | 39.31,55.98 39.52,55.98 41.78,58.24 41.78,58.54 | 47.81,58.82 47.81,59.09 47.27,59.62 U2.3 45.85,59.62 44.78,58.54 41.78,58.54 | U2.5 47.28,58.02 47.81,58.54 47.81,58.82 | 47.81,58.82 U2.21 | J27.3 53.1,5.32 53.1,4.13 | C2.1 C3.1 | 41.78,58.54 R3.2 | J18.3 J19.3 | 43.18,18.32 J21.3 | 43.18,18.32 S2.3 | U7.8 U7.7 U7.6 17.31,32.05 11.9,37.45 11.9,39.84 12.25,40.19 12.8,40.19 16.01,43.39 16.45,43.39 | U12.8 U12.7 U12.6 61.86,36.53 64.77,33.63 J39.3 J40.3 | U11.8 U11.7 U11.6 61.85,28.91 62.81,27.95 62.81,26.09 J37.3 | J34.3 J33.3 61.02,7.62 | J36.3 J35.3 60.96,15.24 J29.3 | J30.3 61.02,8.83 61.02,7.62 | J20.3 36.89,1.21 41.85,1.21 J24.3 | 61.02,7.62 59.75,6.35 J31.3 59.69,4.13 | 59.69,4.13 J32.3 | 53.1,4.13 59.69,4.13 | 53.1,4.13 53.1,3.57 J28.3
  Bottom 0.254: J40.3 69.46,30.87 69.46,25.01 J38.3 69.46,23.25 69.46,16.12 J36.3 | J39.3 63.89,30.87 63.89,25.01 J37.3 | J4.2 J3.2 5.97,7.24 | 44.06,7.23 J23.3 J24.3 | 51.19,7.23 44.06,7.23 | 44.06,7.23 43.18,8.11 J22.3 J21.3 | 51.19,7.23 51.19,9.28 J26.3 J25.3 | J27.3 51.19,7.23 | J29.3 J30.3 | 19.05,4.45 J11.3 J10.3 J9.3 | 3.38,20.8 3.25,20.68 1.85,20.68 1.17,21.35 1.17,35.46 U3.7 9.77,44.06 9.77,46.6 J53.2 10.52,49.17 10.52,54.97 J52.2 6.52,60.79 6.52,68.41 U1.24 | 11.17,4.45 19.05,4.45 | 11.17,4.45 11.17,3.55 J8.2 | 11.17,4.45 11.17,5.34 J7.2 10.16,7.24 | 26.67,4.45 19.05,4.45 | 19.05,4.45 J12.3 | 35.56,4.45 26.67,4.45 | 35.56,4.45 J19.3 | J20.3 35.56,4.45 | 10.16,7.24 5.97,7.24 | 5.97,7.24 5.08,8.14 J2.2 J1.2 5.3,14.19 5.3,18.88 3.38,20.8 | 10.16,7.24 J6.2 J5.2 | J13.3 J14.3 J15.3 26.67,4.45 | U3.2 3.46,23.21 3.46,20.88 3.38,20.8 | J16.3 26.67,4.45 | J45.6 36.83,15.24 J17.3 J18.3
N_IMU_SCL
  Top 0.254: U3.3 1.66,27.55 1.66,37.29 2.08,37.71 9.92,37.71 18.18,29.45 20.91,29.45 21.23,29.13 24.22,29.13 25.8,27.55 U4.28
N_IMU_SDA
  Top 0.254: U3.4 3.42,28.33 3.42,26.3 2.85,25.74 2.17,25.74 1.17,26.74 1.17,37.38 1.96,38.17 10.03,38.17 18.26,29.95 20.99,29.95 21.4,29.54 24.66,29.54 26.6,27.6 U4.27
N_IR0
  Top 0.254: U9.13 13.11,26.34 15.32,24.13 15.32,23.18 16.19,22.32 16.19,17.07 13.97,14.85 J9.1
N_IR1
  Top 0.254: U9.14 13.07,25.7 14.92,23.84 14.92,23.02 15.79,22.15 15.79,17.91 13.09,15.22 13.09,11.92 13.97,11.04 J10.1
N_IR2
  Top 0.254: U9.15 13.14,25.05 14.51,23.68 14.51,22.85 15.38,21.98 15.38,18.37 12.63,15.62 12.63,8.56 13.97,7.23 J11.1
N_IR3
  Top 0.254: U9.12 13.07,27 16.12,23.95 16.12,23.33 16.6,22.85 16.6,15.71 14.85,13.96 14.85,4.3 13.97,3.42 J12.1
N_IR4
  Top 0.254: J13.1 21.59,14.85 18.29,18.15 18.29,24.14 U9.1
N_IR5
  Top 0.254: J14.1 21.59,11.04 20.71,11.04 17.13,14.62 17.13,23.17 16.57,23.73 16.57,26.15 17.41,27 U9.5
N_IR6
  Top 0.254: U9.2 18.7,25.05 19.09,24.65 19.09,22.79 18.9,22.59 18.9,18.87 22.47,15.29 22.47,8.11 21.59,7.23 J15.1
N_IR7
  Top 0.254: U9.4 18.68,26.34 19.09,25.93 19.09,25.22 19.51,24.81 19.51,22.63 19.32,22.44 19.32,19.17 22.92,15.57 22.92,8.86 25.05,6.72 25.05,2.16 24.55,1.66 23.35,1.66 22.47,2.54 J16.1
N_IR_COM  (via drill 0.33 pad 0.69)
  Top 0.254: U9.3 17.37,25.7 16.98,25.3 16.98,24.1 17.47,23.61 v17.64,23.61 | v33.42,24.55 33.19,24.33 29.77,24.33 U4.22
  Bottom 0.254: v33.42,24.55 33.42,21.38 31.55,19.51 23.5,19.51 20.61,22.4 20.61,22.49 19.5,23.61 v17.64,23.61
N_LED1
  Top 0.254: U7.13 26.59,33.34 20.95,38.98 20.95,40.64 17.66,43.93 D1.2
N_LED2  (via drill 0.33 pad 0.69)  (1 unrouted)
  Top 0.254: D2.2 v25.25,37.41 | U7.14 26.86,33.99 v25.25,35.6
  Bottom 0.254: v25.25,35.6 v25.25,37.41
N_LED3
  Top 0.254: U7.15 27.56,34.65 25.7,36.51 24.57,36.51 D3.2
N_LED4  (1 unrouted)
  Top 0.254: U7.12 26.54,32.7 22.94,36.3 D4.2
N_LED5
  Top 0.254: U7.1 17.63,35.3 D5.2
N_LED6  (1 unrouted)
  Top 0.254: U7.5 17.48,32.7 14.07,36.1 D6.2
N_LED7
  Top 0.254: U7.2 18.25,34.65 17.68,34.08 16.71,34.08 15.83,34.96 15.83,35.6 12.59,38.85 D7.2
N_LED8  (1 unrouted)
  Top 0.254: D8.2 13.86,42.44 11.5,40.08 11.5,37.28 17.39,31.39 20.33,31.39 21.42,30.3 23.45,30.3 23.67,30.52 23.67,32.98 23.31,33.34 U7.4
N_LED_A_B  (via drill 0.33 pad 0.69)
  Top 0.254: U6.32 55.28,42.92 v55.84,43.48
  Bottom 0.254: v55.84,43.48 55.84,43.71 58.74,46.6 63.11,46.6 J43.3
N_LED_A_G  (via drill 0.33 pad 0.69)
  Top 0.254: U6.31 55.16,43.72 55.55,44.11 56.63,44.11 v56.9,43.84
  Bottom 0.254: J43.2 64.56,45.93 58.78,45.93 56.9,44.05 v56.9,43.84 | v56.9,43.84
N_LED_A_R  (via drill 0.33 pad 0.69)
  Top 0.254: U6.30 v58.26,44.52
  Bottom 0.254: v58.26,44.52 62.55,44.52 63.89,43.18 J43.1
N_LED_B_B
  Top 0.254: U6.9 61.87,42.3 65.78,42.3 67.54,44.06 67.54,47.22 J44.3
N_LED_B_G
  Top 0.254: U6.2 55.15,40.84 56.56,39.43 59.35,39.43 59.6,39.68 68.88,39.68 69.46,40.26 69.46,44.84 J44.2
N_LED_B_R  (via drill 0.33 pad 0.69)
  Top 0.254: U6.1 | U6.1 | U6.1 54.35,41.05 56.38,39.02 59.51,39.02 59.64,39.15 67.23,39.15 v67.32,39.05
  Bottom 0.254: J44.1 68.58,42.3 67.32,41.04 v67.32,39.05
N_LED_C_B
  Top 0.254: U6.8 67.6,41.62 J42.3
N_LED_C_G
  Top 0.254: U6.11 62.78,44.52 63.31,45.05 63.31,45.56 66.91,49.15 68.93,49.15 69.89,48.19 69.89,39.41 J42.2
N_LED_C_R  (via drill 0.33 pad 0.69)
  Top 0.254: U6.10 63.38,43.72 63.76,44.1 v66.69,44.1
  Bottom 0.254: J42.1 68.58,36.44 66.69,38.33 v66.69,44.1
N_LED_COM
  Top 0.254: U7.3 23.23,33.99 25.88,31.34 25.88,30.02 27.4,28.5 U4.26
N_LED_COMM_A
  Top 0.254: D14.1 D15.1 43.31,62.24 | D16.1 42.8,62.75 43.31,62.24 | R3.1 43.31,62.24
N_LED_COMM_B
  Top 0.254: R5.2 62.63,55.99 58.97,55.99 D11.1
N_LED_D_B
  Top 0.254: U6.7 59.15,41.04 59.7,40.49 64.62,40.49 J41.3
N_LED_D_G  (via drill 0.33 pad 0.69)
  Top 0.254: U6.13 61.87,46.12 v62.69,45.31
  Bottom 0.254: v62.69,45.31 63.57,44.42 65.13,44.42 65.65,43.9 65.65,38.98 J41.2
N_LED_D_R  (via drill 0.33 pad 0.69)
  Top 0.254: U6.12 60.68,45.32 59.83,44.47 v59.83,43.84
  Bottom 0.254: J41.1 64.77,36.44 59.83,41.38 v59.83,43.84
N_LED_GND  (4 unrouted)
  Top 0.254: D1.1 16.09,41.38 D8.1 14.09,40.33 D7.1 14.09,38.41 D6.1 15.81,36.68 17.14,36.68 | D3.1 19.11,40.46 | 19.11,40.46 18.02,39.37 R1.1 17.91,37.36 | 19.11,40.46 19.16,40.51 D2.1 | 17.91,37.36 D4.1 | 17.14,36.68 D5.1 | 17.91,37.36 17.23,36.68 17.14,36.68
N_LED_SEL0
  Top 0.254: U7.11 27.57,32.05 26.71,31.19 26.71,30.34 28.2,28.85 U4.25
N_LED_SEL1
  Top 0.254: U7.10 27.53,31.39 27.14,31 27.14,30.49 29.5,28.13 U4.24
N_LED_SEL2
  Top 0.254: U7.9 30.59,28.36 30.59,25.37 30.07,24.86 U4.23
N_LIGHT_A0  (via drill 0.33 pad 0.69)
  Top 0.254: v55.76,24.6 55.84,24.6 58.11,26.88 58.11,33.94 56.81,35.23 U12.13
  Bottom 0.254: J33.1 64.77,3.42 62.56,5.62 62.56,12.48 55.76,19.28 v55.76,24.6
N_LIGHT_A1  (via drill 0.33 pad 0.69)
  Top 0.254: U12.14 56.58,34.59 v56.96,34.2
  Bottom 0.254: J34.1 68.58,3.42 67.7,3.42 63.29,7.83 63.29,23.26 56.8,29.74 56.8,34.05 v56.96,34.2
N_LIGHT_A2  (via drill 0.33 pad 0.69)
  Top 0.254: U12.15 56.31,33.94 v57.48,32.77
  Bottom 0.254: J35.1 64.77,11.04 63.89,11.92 63.89,23.43 57.48,29.83 v57.48,32.77
N_LIGHT_A3
  Top 0.254: J36.1 68.58,11.04 69.87,12.32 69.87,32.67 65.43,37.1 63.88,37.1 62.27,38.71 60.19,38.71 57.37,35.88 U12.12
N_LIGHT_A4
  Top 0.254: J37.1 64.77,19.93 65.65,20.81 65.65,24.53 64.64,25.54 64.3,25.54 63.89,25.95 63.89,27.91 62.27,29.52 62.27,32.23 U12.1
N_LIGHT_A5
  Top 0.254: J38.1 68.58,19.93 69.46,20.81 69.46,32.5 65.26,36.7 63.71,36.7 62.1,38.3 60.4,38.3 60.1,37.99 60.1,36.35 60.56,35.88 U12.5
N_LIGHT_A6
  Top 0.254: U12.2 61.86,33.94 63.27,32.52 63.27,29.15 64.77,27.65 J39.1
N_LIGHT_A7
  Top 0.254: J40.1 68.58,27.55 67.7,27.55 63.85,31.4 63.85,33.26 61.88,35.23 U12.4
N_LIGHT_B0
  Top 0.254: J25.1 46.99,20.61 51.54,25.16 53.05,25.16 53.37,25.48 53.37,26 54.98,27.61 U11.13
N_LIGHT_B1
  Top 0.254: J26.1 46.99,11.04 47.87,11.92 47.87,20.84 51.79,24.75 53.22,24.75 53.78,25.31 53.78,25.78 54.96,26.96 U11.14
N_LIGHT_B2
  Top 0.254: J27.1 46.99,7.23 48.43,8.67 48.43,20.82 51.95,24.35 53.39,24.35 54.18,25.14 54.18,25.5 54.99,26.32 U11.15
N_LIGHT_B3
  Top 0.254: J28.1 46.99,3.42 46.11,4.3 46.11,22.81 51.56,28.27 U11.12
N_LIGHT_B4
  Top 0.254: J29.1 54.61,14.85 56.16,16.39 56.16,21.76 60.06,25.66 U11.1
N_LIGHT_B5
  Top 0.254: J30.1 54.61,11.04 53.31,12.34 53.31,15.93 54.92,17.54 54.92,22.61 60.58,28.27 U11.5
N_LIGHT_B6
  Top 0.254: J31.1 55.49,6.35 56.37,5.47 57.56,5.47 58.03,5.94 58.03,6.77 55.49,9.31 55.49,11.49 53.72,13.26 53.72,15.21 55.74,17.22 55.74,21.92 60.13,26.32 U11.2
N_LIGHT_B7
  Top 0.254: J32.1 55.49,2.54 56.37,1.66 60.09,1.66 65.17,6.74 69,6.74 69.46,7.2 69.46,8.05 68.75,8.76 68.33,8.76 67.7,9.39 67.7,13.06 69.46,14.82 69.46,15.67 68.75,16.38 65.81,16.38 63.55,18.64 63.55,21.57 62.34,22.78 62.34,27.16 61.88,27.61 U11.4
N_PUSH0  (via drill 0.33 pad 0.69)
  Top 0.254: v31.85,25.76 36.03,29.94 S1.1 | U4.30 24.2,26.39 26.38,24.21 v27.78,24.21
  Bottom 0.254: v27.78,24.21 27.89,24.21 30.48,21.63 30.48,21.52 30.81,21.18 31.44,21.18 31.76,21.5 31.76,22.39 31.7,22.45 31.7,25.62 v31.85,25.76
N_PUSH1  (via drill 0.33 pad 0.69)
  Top 0.254: v32.33,23.26 32.51,23.43 36.26,23.43 39.58,26.76 44.01,26.76 44.27,26.5 44.27,22.89 S2.1 | U4.31 23.4,26.37 26.43,23.34 v27.88,23.34
  Bottom 0.254: v27.88,23.34 30.45,20.78 31.61,20.78 32.33,21.5 v32.33,23.26
N_RESET  (via drill 0.33 pad 0.69)
  Top 0.254: v52.73,59.99 52.32,59.99 50.4,61.91 U2.29 | U6.29 54.63,45.32 55.77,46.46 v55.77,47.02 | v28.15,25.66 25.7,25.66 25,26.36 U4.29
  Bottom 0.254: 55.77,47.39 v55.77,47.02 | 55.77,47.39 55.77,47.48 55.2,48.05 51.08,48.05 42.75,39.72 35.91,39.72 J45.5 28.15,31.96 v28.15,25.66 | 55.77,47.39 59.24,47.39 59.63,47.77 59.63,53.09 v52.73,59.99
N_SPI1  (via drill 0.33 pad 0.69)
  Top 0.254: J48.1 21.2,63.5 23.37,65.67 27.61,65.67 28.57,64.7 U5.9 | v26.39,20.78 26.6,20.57 U4.14
  Bottom 0.254: v26.39,20.78 24.44,22.73 24.44,24.91 15.46,33.89 15.46,59.88 18.2,62.62 18.56,62.62 19.44,63.5 J48.1
N_SPI2
  Top 0.254: J48.2 21.46,62.1 27.91,62.1 29.84,64.03 U5.8 29.84,64.7 30.81,65.67 32.72,65.67 33.02,65.37 33.02,63.44 33.36,63.11 33.94,63.11 34.37,63.54 34.37,65.44 36.63,67.7 47.35,67.7 49.12,69.47 65.52,69.47 66.22,68.77 66.22,51.28 61.85,46.92 U6.14
N_SPI3
  Top 0.254: U5.7 31.11,64.09 28.72,61.69 23.59,61.69 J48.3
N_SPI4
  Top 0.254: U5.6 32.38,64.1 29.58,61.29 25.73,61.29 J48.4
N_SPI5
  Top 0.254: J49.1 18.66,63.5 21.25,66.09 32.87,66.09 33.66,65.31 U5.5
N_SPI6
  Top 0.254: U5.4 34.92,63.52 31.73,60.32 27.03,60.32 21.67,54.96 19.93,54.96 19.05,55.85 19.05,59.69 J49.2
N_SPI7
  Top 0.254: J49.3 17.8,58.4 17.8,57.19 16.9,56.29 16.9,55.51 18.27,54.14 22.32,54.14 27.41,59.22 31.9,59.22 36.2,63.52 U5.3
N_SPI8
  Top 0.254: U5.2 37.47,64.72 36.5,65.68 35.9,65.68 35.56,65.34 35.56,63.45 31.97,59.87 27.48,59.87 22.16,54.55 19.11,54.55 J49.4
N_SPI9  (via drill 0.33 pad 0.69)
  Top 0.254: U5.23 37.47,54.62 36.07,53.22 v34.17,53.22 | J50.1 5.96,63.5 5.96,62.73 10.03,58.66 v16.1,58.66
  Bottom 0.254: v16.1,58.66 16.1,57.63 16.97,56.76 26.9,56.76 30.82,52.84 33.79,52.84 v34.17,53.22
N_SPI10  (via drill 0.33 pad 0.69)
  Top 0.254: U5.22 36.2,55.29 34.31,57.17 29.81,57.17 29.16,56.52 v29.16,56.44 | v17.18,57.45 8.59,57.45 J50.2
  Bottom 0.254: v17.18,57.45 28.15,57.45 v29.16,56.44
N_SPI11  (via drill 0.33 pad 0.69)
  Top 0.254: U5.21 34.92,55.32 33.77,56.47 v30,56.47
  Bottom 0.254: J50.3 6.01,59.35 6.01,66.18 5.44,66.75 5.44,68.97 5.95,69.48 6.69,69.48 10.04,66.13 20.44,66.13 30,56.58 v30,56.47
N_SPI12
  Top 0.254: J50.4 6.49,54.47 11.9,54.47 13.34,53.03 27.94,53.03 28.22,52.76 32.33,52.76 33.66,54.09 U5.20
N_SPI13  (via drill 0.33 pad 0.69)
  Top 0.254: U5.19 32.38,53.73 v32.15,53.49
  Bottom 0.254: J51.1 2.54,67.27 5.58,70.31 10.99,70.31 13.61,67.7 20.3,67.7 32.15,55.85 v32.15,53.49
N_SPI14  (via drill 0.33 pad 0.69)
  Top 0.254: U5.18 31.29,54.82 v31.29,53.5
  Bottom 0.254: J51.2 3.85,62.27 3.85,67.95 5.78,69.89 8.88,69.89 11.82,66.95 20.46,66.95 31.29,56.12 v31.29,53.5
N_SPI15  (via drill 0.33 pad 0.69)
  Top 0.254: v16.18,55.51 14.69,57.01 7.4,57.01 7.17,57.23 3.73,57.23 J51.3 | U5.17 29.84,54.66 28.56,53.38 v28.47,53.38
  Bottom 0.254: v28.47,53.38 18.31,53.38 v16.18,55.51
N_SPI16
  Top 0.254: J51.4 3.46,56.8 6.74,56.8 8.67,54.87 12.11,54.87 13.25,53.73 27.66,53.73 28.57,54.65 U5.16
N_SS_COM  (via drill 0.33 pad 0.69)
  Top 0.254: v51.23,55.67 52,54.9 U2.14 | U5.1 38.86,64.39 v39.8,63.45
  Bottom 0.254: v39.8,63.45 47.57,55.67 v51.23,55.67
N_SS_SEL0  (via drill 0.33 pad 0.69)
  Top 0.254: U2.12 50.4,53.75 49.86,53.21 v44.45,53.21 | U5.10 28.02,63.68 v28.02,63.08
  Bottom 0.254: v44.45,53.21 44.09,53.21 34.22,63.08 v28.02,63.08
N_SS_SEL1  (via drill 0.33 pad 0.69)
  Top 0.254: U5.11 26.04,64.05 v27.18,62.91 | U2.13 51.2,53.69 49.36,51.85 v44.4,51.85
  Bottom 0.254: v44.4,51.85 38.23,51.85 v27.18,62.91
N_SS_SEL2  (via drill 0.33 pad 0.69)
  Top 0.254: U5.14 26.04,55.31 29.12,58.4 v41.05,58.4 | v45.39,56.09 45.72,56.42 U2.7
  Bottom 0.254: v45.39,56.09 43.08,58.4 v41.05,58.4
N_SS_SEL3  (via drill 0.33 pad 0.69)
  Top 0.254: U5.13 24.77,55.29 28.29,58.82 38.22,58.82 v38.96,59.55 | U2.8 46.08,54.99 v44.43,54.99
  Bottom 0.254: v44.43,54.99 43.51,54.99 v38.96,59.55
N_STATUS_LED0  (via drill 0.33 pad 0.69)
  Top 0.254: D14.2 46,64.53 v47.18,64.53 | U2.26 52.8,63.09 49.93,65.96 v47.18,65.96
  Bottom 0.254: v47.18,64.53 v47.18,65.96
N_STATUS_LED1
  Top 0.254: U2.27 52,63.12 49.97,65.15 44.72,65.15 D15.2
N_STATUS_LED2
  Top 0.254: U2.28 51.2,63.12 50.55,63.77 46.88,63.77 46.63,63.53 42.63,63.53 D16.2
N_TEMP0
  Top 0.254: J17.1 30.48,17.1 33.37,20 U10.13
N_TEMP1
  Top 0.254: J18.1 30.48,11.04 31.36,11.92 31.36,17.32 33.39,19.34 U10.14
N_TEMP2
  Top 0.254: U10.15 33.41,18.7 32.14,17.43 32.14,8.89 30.48,7.23 J19.1
N_TEMP3
  Top 0.254: J20.1 30.48,3.42 29.6,4.3 29.6,16.84 33.4,20.64 U10.12
N_TEMP4
  Top 0.254: J21.1 38.1,16.52 U10.1
N_TEMP5
  Top 0.254: J22.1 38.1,9.28 38.98,8.4 38.98,5.63 37.21,3.86 37.21,1.8 37.35,1.66 38.88,1.66 39.39,2.17 39.39,3.01 41.55,5.17 41.55,19.39 40.29,20.64 U10.5
N_TEMP6
  Top 0.254: J23.1 38.1,7.23 37.22,8.11 37.22,16.94 38.98,18.7 U10.2
N_TEMP7
  Top 0.254: J24.1 38.1,3.42 39.72,5.04 39.72,15.99 40.7,16.98 40.7,19.57 40.27,20 U10.4
N_TEMP_COM
  Top 0.254: U4.19 30.07,21.66 30.89,22.48 32.49,22.48 33.03,23.03 35.25,23.03 38.93,19.34 U10.3
N_VCC  (via drill 0.33 pad 0.69)
  Top 0.254: U9.16 12.44,24.34 14.97,21.81 14.97,18.9 12.23,16.16 12.23,2.68 13.25,1.66 15.63,1.66 J12.2 16.51,4.38 17.49,5.37 | 50.67,36.32 51.05,36.7 51.57,36.7 54.98,33.28 U12.16 57.1,31.8 57.1,26.52 56.25,25.66 U11.16 53.62,23.66 51.85,23.66 49.53,21.35 J25.2 | 50.67,36.32 | 50.67,36.32 S3.5 S3.3 S3.1 43.42,35.3 U7.16 | 32.23,48.18 36.83,43.58 J45.2 | 32.23,48.18 32.15,48.26 C3.2 C2.2 27.99,51.51 23.41,51.51 C1.1 15.84,50.96 C4.2 C5.2 | U5.24 38.73,54.68 32.23,48.18 | U1.1 64.77,67.7 65.53,66.94 R5.1 | J52.1 12.31,53.34 12.31,52.59 C5.2 | J53.1 11.43,46.6 10.54,47.49 10.54,48.77 C5.2 | U8.16 5.46,30.37 v5.75,30.08 | J34.2 J33.2 | J11.2 17.49,5.37 | J16.2 24.13,4.38 23.15,5.37 | 17.49,5.37 23.15,5.37 | 23.15,5.37 J15.2 | J30.2 57.15,11.43 58.42,12.7 | J35.2 58.42,12.7 | 58.42,12.7 J29.2 | J26.2 J27.2 | J17.2 33.02,17.04 U10.16 | J19.2 J20.2
  Bottom 0.254: 34.33,8.85 J18.2 J17.2 32.14,14.85 25.01,14.85 J13.2 J14.2 J15.2 | 40.64,8.85 34.33,8.85 | 34.33,8.85 34.33,7.66 J19.2 | 40.64,8.85 J22.2 J21.2 | 40.64,8.85 J23.2 J24.2 41.52,1.66 48.65,1.66 J28.2 49.53,4.45 | 6.24,29.07 1.66,24.5 1.66,23.35 2.54,22.47 U3.1 | 6.24,29.07 6.24,29.59 v5.75,30.08 5.75,34.07 11.43,39.76 J53.1 | 6.24,29.07 7.64,29.07 16.51,20.2 J9.2 J10.2 J11.2 | U1.1 64.77,67.7 66.07,66.4 66.07,30.43 | J30.2 J31.2 57.15,4.45 | J32.2 57.15,4.45 | 49.53,4.45 57.15,4.45 | J27.2 49.53,4.45 | J26.2 J25.2 | J34.2 67.6,6.06 67.6,11.72 | 67.6,11.72 J36.2 | 65.66,20.7 J37.2 | 65.66,20.7 65.66,12.7 | J35.2 65.66,12.7 | 65.66,12.7 66.62,12.7 67.6,11.72 | J38.2 67.7,22.47 | 67.7,22.47 67.43,22.47 65.66,20.7 | 66.07,30.43 65.99,30.43 J39.2 | 66.07,30.43 67.93,28.56 | 67.7,22.47 67.7,28.33 67.93,28.56 | 67.93,28.56 J40.2
N_VCC_MCU0
  Top 0.254: 45.63,57.22 43.78,55.36 43.78,45.63 S3.2 | 45.63,57.22 U2.6 46.9,57.42 53.81,57.42 | 45.63,57.22 45.6,57.26 45.6,58.36 46.06,58.82 U2.4 | 53.81,57.42 53.81,56.92 54.31,56.42 U2.18 | U2.20 54.3,58.02 53.81,57.54 53.81,57.42
N_VCC_MCU1  (via drill 0.33 pad 0.69)
  Top 0.254: 22.39,22.18 22.39,22.75 21.89,23.26 U4.4 | U4.6 21.87,21.66 22.39,22.18 | 28.41,21.95 28.18,22.18 22.39,22.18 | v35.12,36.34 38.46,36.34 46.99,44.87 S3.4 | v30.8,23.1 30.15,22.46 U4.20 28.92,22.46 28.41,21.95 | 28.41,21.95 28.41,21.33 28.89,20.86 U4.18
  Bottom 0.254: v30.8,23.1 30.8,32.02 v35.12,36.34
N_VCC_MCU2
  Top 0.254: S3.6 49.53,47.6 53.27,51.34 56.62,51.34 57.55,50.41 U6.20 57.55,49.23 58.09,48.7 58.34,48.7 | 58.35,42.74 U6.6 | 58.34,48.7 58.34,46.64 58.88,46.1 58.88,43.26 58.35,42.74 | 58.35,42.74 57.3,42.74 56.75,42.19 U6.4 | U6.18 59.15,49.25 58.6,48.7 58.34,48.7

### Text on the board
Top: Ernest Gu
bPlace: SENSORY OVERLOAD | rev-1.0
tSilkscreen: 1 | 2 | 3 | A | R-G-B | o | + | D A / C B | o | + | 1 | 8 | 2 | SCK / MISO / MOSI | C | 7 | 3 | 6 | 4 | 5 | A | B | C | B | PD0 | PD1 | W-B | W-R-B | 1-4 | 5-8 | IR 1-4 5-8 | TEMP 1-4 5-8 | LGT_B 1-4 5-8 | LGT_A 1 3 5 7